# Altium schematic sheet Condor2_Servo_REV_C.SchDoc
size A4; DrawnBy: Philip Rowse
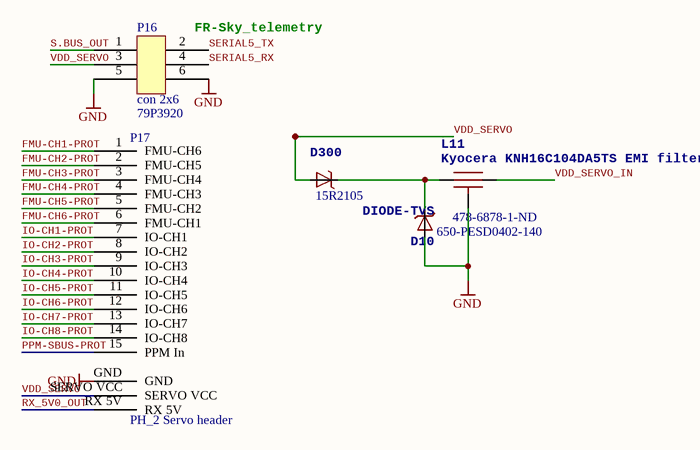
[diagram p0: Condor2_Servo_REV_C.SchDoc]

## Parts
D10  DIODE-TVS  Supplier Part Number 1: 650-PESD0402-140  [0402-TVS]
D300  Supplier Part Number 1: 15R2105  [MICROSMP]  (hidden comment: MSS1P4-M3)
L11  Kyocera KNH16C104DA5TS EMI filter  Supplier Part Number 1: 478-6878-1-ND  [KYOCERA-KNH16-DA]
P16  con 2x6  Supplier Part Number 1: 79P3920  [TSW-103-07-G-D]
P17  PH_2 Servo header  [TSW-115-08-G-T-RA]

## Nets
GND: D10.A L11.GND P16.5 P16.6 P17.GND
FMU-CH1-PROT: P17.1(FMU-CH6)
FMU-CH2-PROT: P17.2(FMU-CH5)
FMU-CH3-PROT: P17.3(FMU-CH4)
FMU-CH4-PROT: P17.4(FMU-CH3)
FMU-CH5-PROT: P17.5(FMU-CH2)
FMU-CH6-PROT: P17.6(FMU-CH1)
IO-CH1-PROT: P17.7(IO-CH1)
IO-CH2-PROT: P17.8(IO-CH2)
IO-CH3-PROT: P17.9(IO-CH3)
IO-CH4-PROT: P17.10(IO-CH4)
IO-CH5-PROT: P17.11(IO-CH5)
IO-CH6-PROT: P17.12(IO-CH6)
IO-CH7-PROT: P17.13(IO-CH7)
IO-CH8-PROT: P17.14(IO-CH8)
PPM-SBUS-PROT: P17.15(PPM_In)
RX_5V0_OUT: P17.RX_5V
S.BUS_OUT: P16.1
SERIAL5_RX: P16.4
SERIAL5_TX: P16.2
VDD_SERVO: D300.ANODE(A) P16.3 P17.SERVO_VCC
VDD_SERVO_IN: L11.P$2
NetD10_C: D10.C D300.CATHODE(C) L11.P$1

## Notes on the sheet
- (near P16) FR-Sky_telemetry
- Title
- Size:
- Date:
- A4
- Number:
- Time:
- Revision:
- Sheet
- of
- File:

## Library data of the parts
D10 = DIODE-TVS: Diode, TVS, 14VWM, 40VC, 0402, SMD; Supplier 1: Mouser
D300 = DIODE-SCHOTTKY_MSMP: Diode, Schottky, 40V, 1A, MicroSMP, SMD; Supplier 1: Newark
L11 = KNH16C104DA5TS: Capacitor, Filter, 0.1uF, 25V, 2A, 0603, SMD; Supplier 1: Digi-Key
P16 = con 2x6: Connector, Header, 6Pos, 2.54MM, Vert, THT, Au; Supplier 1: Newark
P17 = PH_2 Servo header: Connector, Header, 45Pos, 2.54MM, R/A, THT, Tin